# Altium schematic sheet Sheet1.SchDoc
size A4
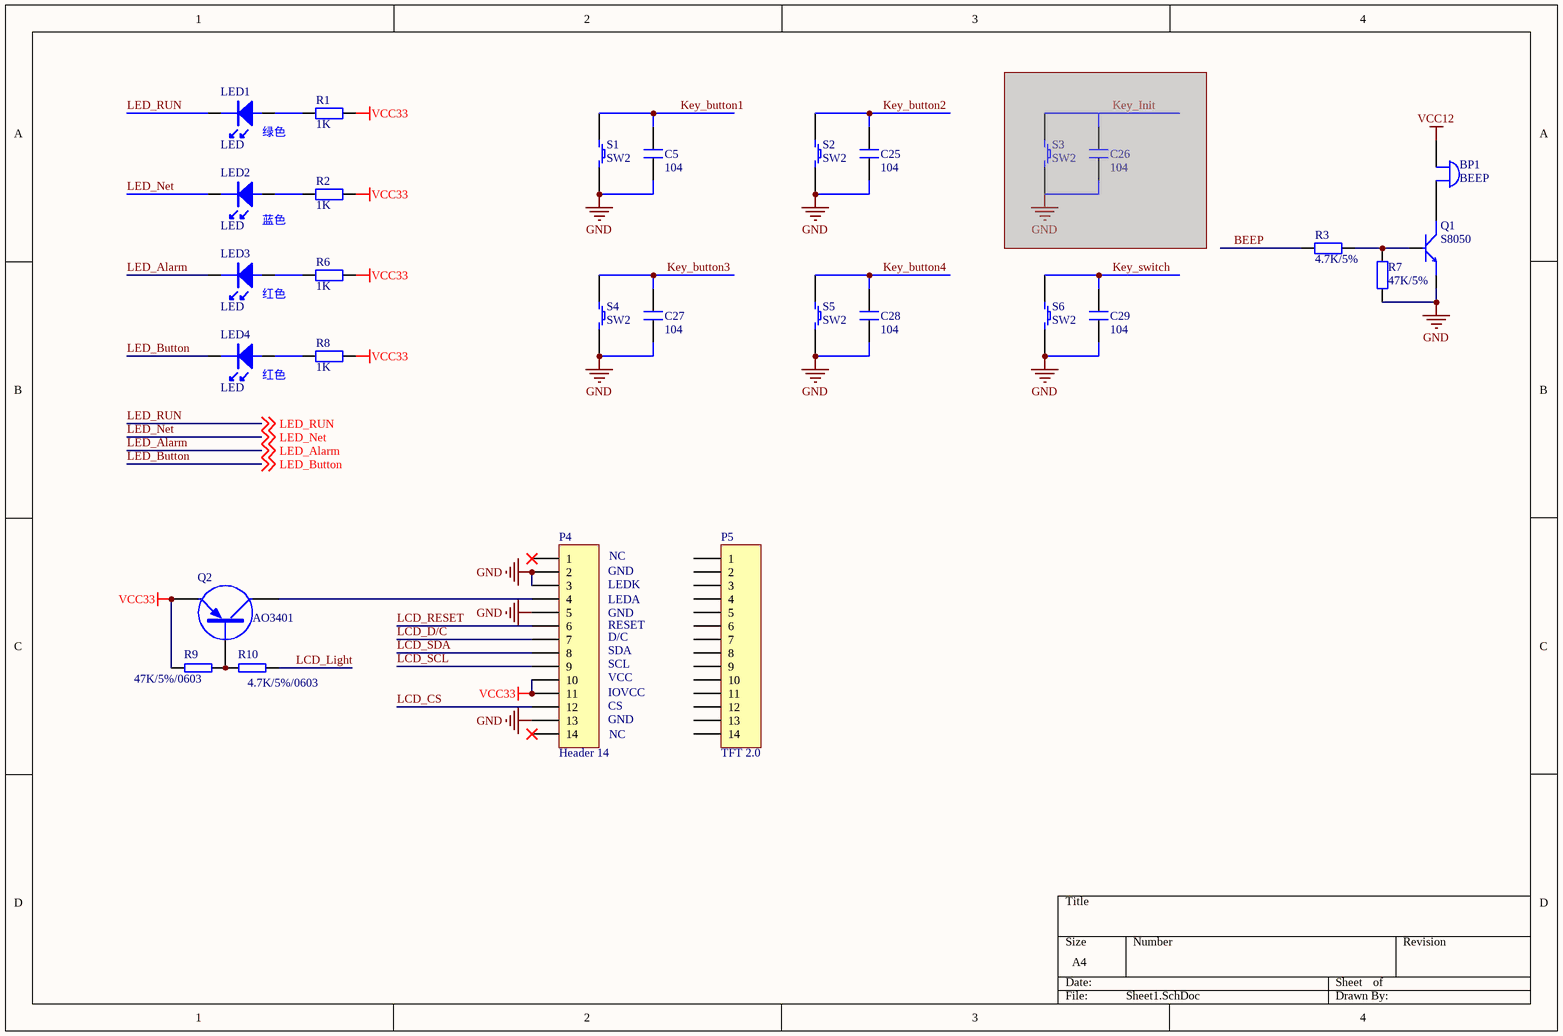
[diagram p0: Sheet1.SchDoc]

## Parts
BP1  BEEP  [XHXDZ-SMD9650]
C5  104  [0603R]
C25  104  [0603R]
C26  104  [0603R]  (masked out: inside a compile mask, not in the netlist)
C27  104  [0603R]
C28  104  [0603R]
C29  104  [0603R]
LED1  LED  [LED]
LED2  LED  [Led]
LED3  LED  [led]
LED4  LED  [led]
P4  Header 14  [0.5mm间距FPC排座上接14pin]
P5  TFT 2.0  [2.0寸TFT彩屏]
Q1  S8050  [SOT-23]
Q2  AO3401  [SOT-23]
R1  value 1K  [0603R]  (hidden comment: Res2)
R2  value 1K  [0603R]  (hidden comment: Res2)
R3  4.7K/5%  [0603R]
R6  value 1K  [0603R]  (hidden comment: Res2)
R7  47K/5%  [0603R]
R8  value 1K  [0603R]  (hidden comment: Res2)
R9  47K/5%/0603  [0603R]
R10  4.7K/5%/0603  [0603R]
S1  SW2  [4.5*4.5贴片4脚独立按键]
S2  SW2  [4.5*4.5贴片4脚独立按键]
S3  SW2  [4.5*4.5贴片4脚独立按键]  (masked out: inside a compile mask, not in the netlist)
S4  SW2  [4.5*4.5贴片4脚独立按键]
S5  SW2  [4.5*4.5贴片4脚独立按键]
S6  SW2  [4.5*4.5贴片4脚独立按键]

## Nets
GND: C5.2 C25.2 C27.2 C28.2 C29.2 P4.2 P4.3 P4.5 P4.13 Q1.2(E) R7.2 S1.2 S2.2 S4.2 S5.2 S6.2
VCC12: BP1.1
VCC33: P4.10 P4.11 Q2.2(E) R1.1 R2.1 R6.1 R8.1 R9.2
BEEP: R3.1
Key_button1: C5.1 S1.1
Key_button2: C25.1 S2.1
Key_button3: C27.1 S4.1
Key_button4: C28.1 S5.1
Key_switch: C29.1 S6.1
LCD_CS: P4.12
LCD_D/C: P4.7
LCD_Light: R10.2
LCD_RESET: P4.6
LCD_SCL: P4.9
LCD_SDA: P4.8
LED_Alarm: LED3.2 ; off-sheet LED_Alarm
LED_Button: LED4.2 ; off-sheet LED_Button
LED_Net: LED2.2 ; off-sheet LED_Net
LED_RUN: LED1.2 ; off-sheet LED_RUN
NetBP1_2: BP1.2 Q1.3(C)
NetLED1_1: LED1.1 R1.2
NetLED2_1: LED2.1 R2.2
NetLED3_1: LED3.1 R6.2
NetLED4_1: LED4.1 R8.2
NetP4_4: P4.4 Q2.3(C)
NetQ1_1: Q1.1(B) R3.2 R7.1
NetQ2_1: Q2.1(B) R9.1 R10.1

Not connected (* = marked no-connect by the designer): P4 1* 14*; P5 1 2 3 4 5 6 7 8 9 10 11 12 13 14

## Notes on the sheet
- (near LED1) 绿色
- (near LED2) 蓝色
- (near LED3) 红色
- (near LED4) 红色
- (near P4) GND
- (near P4) NC
- (near P4) LEDK
- (near P4) LEDA
- (near P4) RESET
- (near P4) D/C
- (near P4) SDA
- (near P4) SCL
- (near P4) VCC
- (near P4) IOVCC
- (near P4) CS

## Library data of the parts
C5 C25-C29 = CAP
P4 = Header 14: Header, 14-Pin; LatestRevisionDate: 17-Jul-2002; LatestRevisionNote: Re-released for DXP Platform.; Publisher: Altium Limited
P5 = Header 14: LatestRevisionDate: 17-Jul-2002; LatestRevisionNote: Re-released for DXP Platform.; Publisher: Altium Limited
Q1 = NPN_1
Q2 = PNP
R3 R7 = Res2: Resistor; Published: 8-Jun-2000; LatestRevisionDate: 17-Jul-2002; LatestRevisionNote: Re-released for DXP Platform.; PackageReference: AXIAL-0.4; Publisher: Altium Limited; PackageDescription: Axial Device, Thru-Hole; 2 Leads; 0.4 in Pin Spacing
R9 R10 = RES
R1 R2 R6 R8 = Res2: Published: 8-Jun-2000; LatestRevisionDate: 17-Jul-2002; LatestRevisionNote: Re-released for DXP Platform.; PackageReference: AXIAL-0.4; Publisher: Altium Limited; PackageDescription: Axial Device, Thru-Hole; 2 Leads; 0.4 in Pin Spacing